# EAGLE design Initial Schematic (EAGLE 9.6.2)
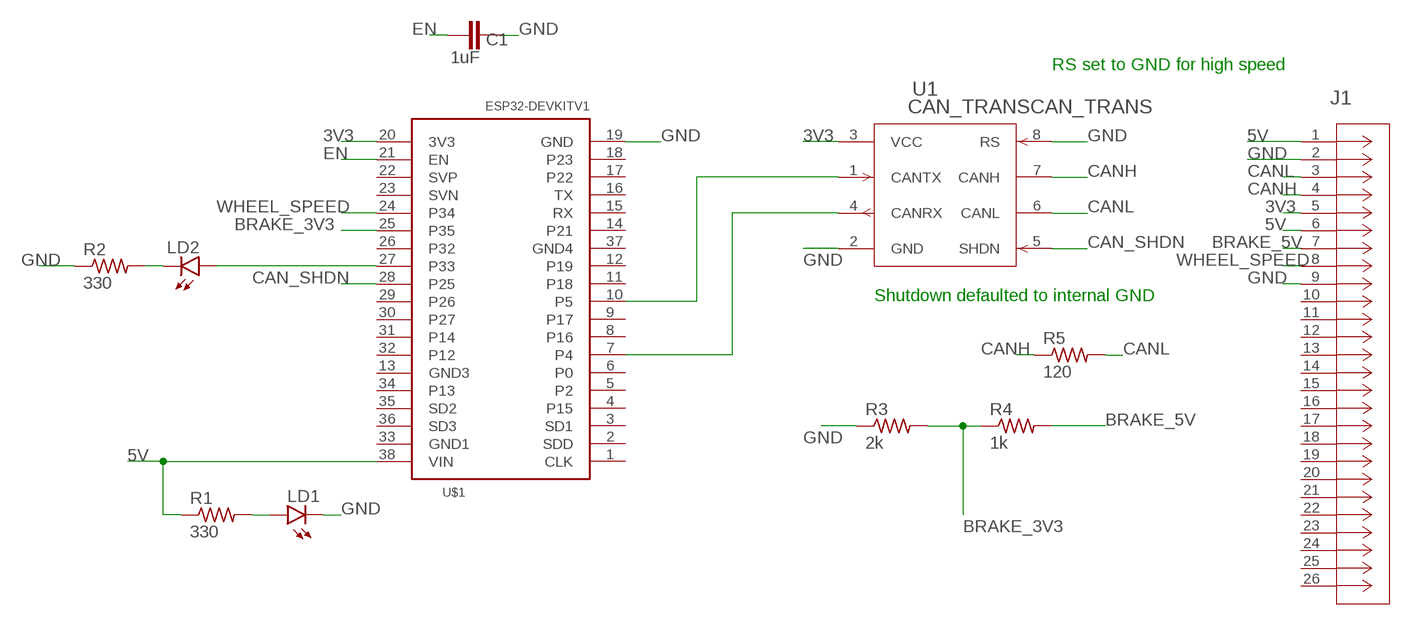
[diagram p0: schematic, sheet 1]

## Parts
C1  1uF  CAPACITORC1206  [C1206]
J1  CONNECTOR  [CONN26_9-6437287-8_TEC]
LD1  PL006-WCR21  [SOT23]
LD2  PL006-WCR21  [SOT23]
R1  330  RESISTORR1206  [R1206]
R2  330  RESISTORR1206  [R1206]
R3  2k  RESISTORR1206  [R1206]
R4  1k  RESISTORR1206  [R1206]
R5  120  RESISTORR1206  [R1206]
U1  CAN_TRANSCAN_TRANS  [MAX3051ESA+]
U$1  ESP32DEVKITV1  [ESP32-DEVKITV1]

## Nets
3V3: J1.5 U1.3(VCC) U$1.20(3V3)
5V: J1.1 J1.6 R1.1 U$1.38(VIN)
BRAKE_3V3: R3.2 R4.1 U$1.25(P35)
BRAKE_5V: J1.7 R4.2
CAN_SHDN: U1.5(SHDN) U$1.28(P25)
CANH: J1.4 R5.1 U1.7(CANH)
CANL: J1.3 R5.2 U1.6(CANL)
EN: C1.2 U$1.21(EN)
GND: C1.1 J1.2 J1.9 LD1.1(C) R2.1 R3.1 U1.2(GND) U1.8(RS) U$1.19(GND)
N$1: U1.1(CANTX) U$1.10(P5)
N$2: LD1.3(A) R1.2
N$3: U1.4(CANRX) U$1.7(P4)
N$4: LD2.3(A) U$1.27(P33)
N$5: LD2.1(C) R2.2
WHEEL_SPEED: J1.8 U$1.24(P34)
Unconnected: J1.10 J1.11 J1.12 J1.13 J1.14 J1.15 J1.16 J1.17 J1.18 J1.19 J1.20 J1.21 J1.22 J1.23 J1.24 J1.25 J1.26 U$1.1(CLK) U$1.2(SDD) U$1.3(SD1) U$1.4(P15) U$1.5(P2) U$1.6(P0) U$1.8(P16) U$1.9(P17) U$1.11(P18) U$1.12(P19) U$1.13(GND3) U$1.14(P21) U$1.15(RX) U$1.16(TX) U$1.17(P22) U$1.18(P23) U$1.22(SVP) U$1.23(SVN) U$1.26(P32) U$1.29(P26) U$1.30(P27) U$1.31(P14) U$1.32(P12) U$1.33(GND1) U$1.34(P13) U$1.35(SD2) U$1.36(SD3) U$1.37(GND4)

## Notes on the sheet
- RS set to GND for high speed
- Shutdown defaulted to internal GND

## Library data of the parts
C1 = NFR23:CAPACITOR: CAPACITOR, European symbol
J1 = NFR23:CONNECTOR; COPYRIGHT: Copyright (C) 2022 Ultra Librarian. All rights reserved.; DIGI-KEY_PART_NUMBER_1: A126097-ND; MANUFACTURER_PART_NUMBER: 9-6437287-8; MFR_NAME: TE Connectivity; TYPE: -
LD1 LD2 = led:PL006*: PLH006 Series SMD LED SOT23 PLH006-WCR21 Super Red PLH006-WCR12 High Eff Red PLH006-WCG13 Green PLH006-WCY01 Yellow www.p-tec.net Source: http://www.wittig-electronic.de/PTEC/PL006Series.pdf
R1-R5 = NFR23:RESISTOR: RESISTOR, American symbol; SPICEPREFIX: R
U1 = NFR23:CAN_TRANS; COPYRIGHT: Copyright (C) 2022 Ultra Librarian. All rights reserved.; DIGI-KEY_PART_NUMBER_1: MAX3051ESA+-ND; MANUFACTURER_PART_NUMBER: MAX3051ESA+; MFR_NAME: Maxim Integrated Products
U$1 = NFR23:ESP32DEVKITV1

## Board
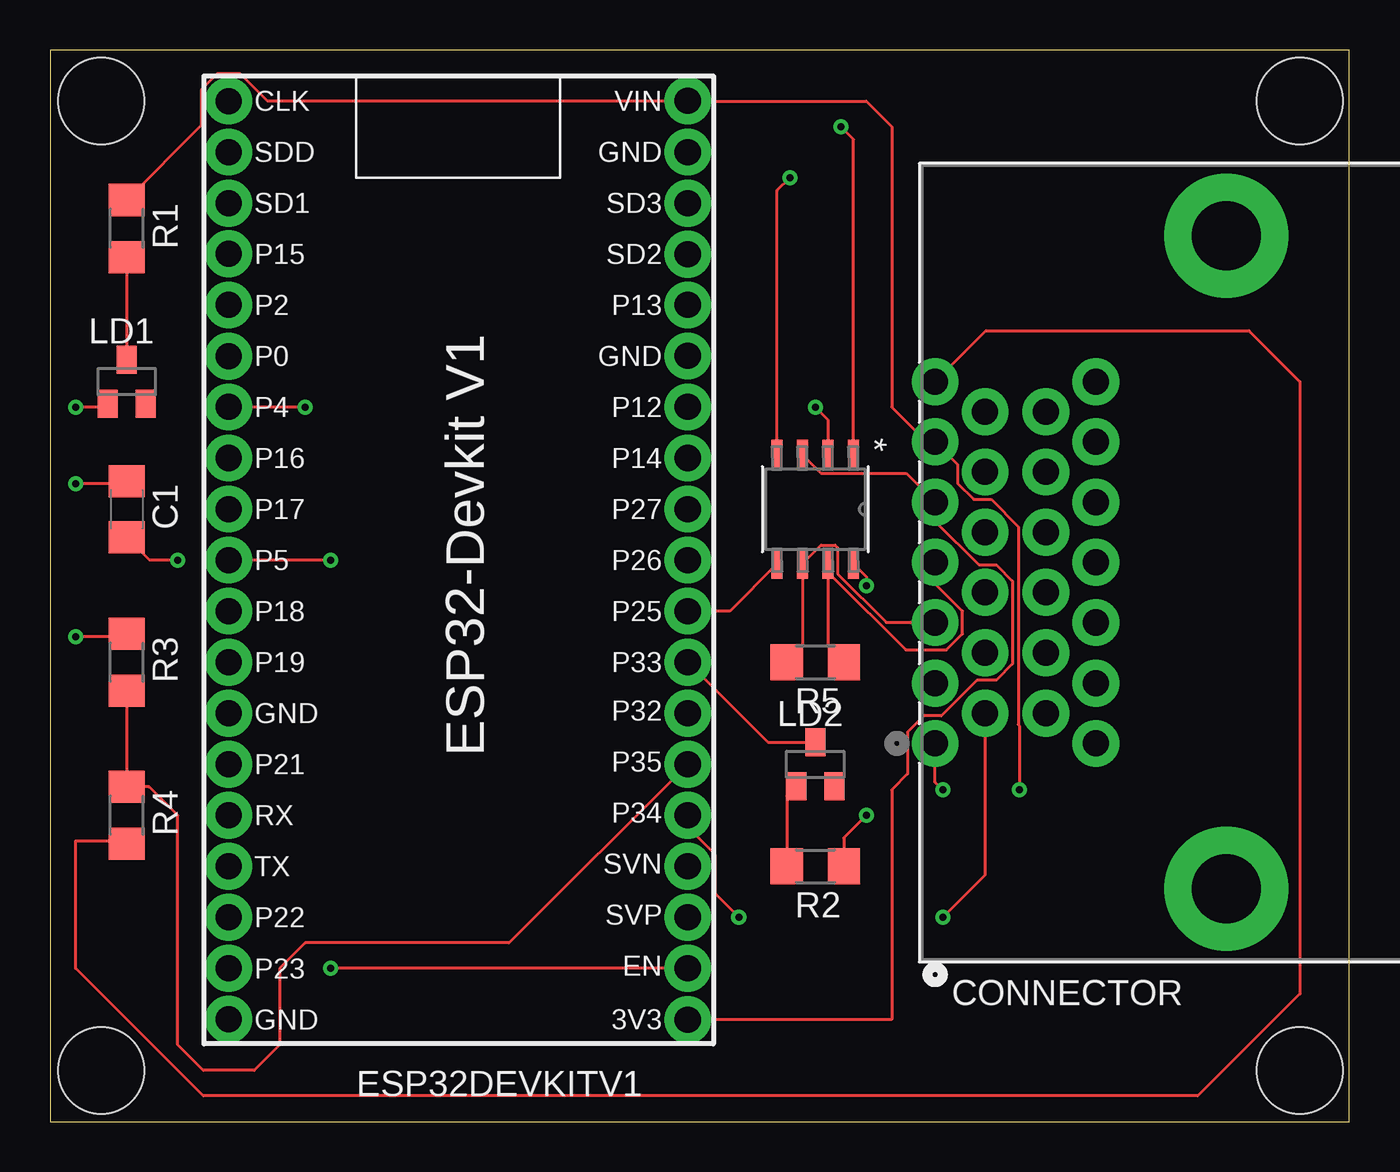
[diagram p1: board, top side]
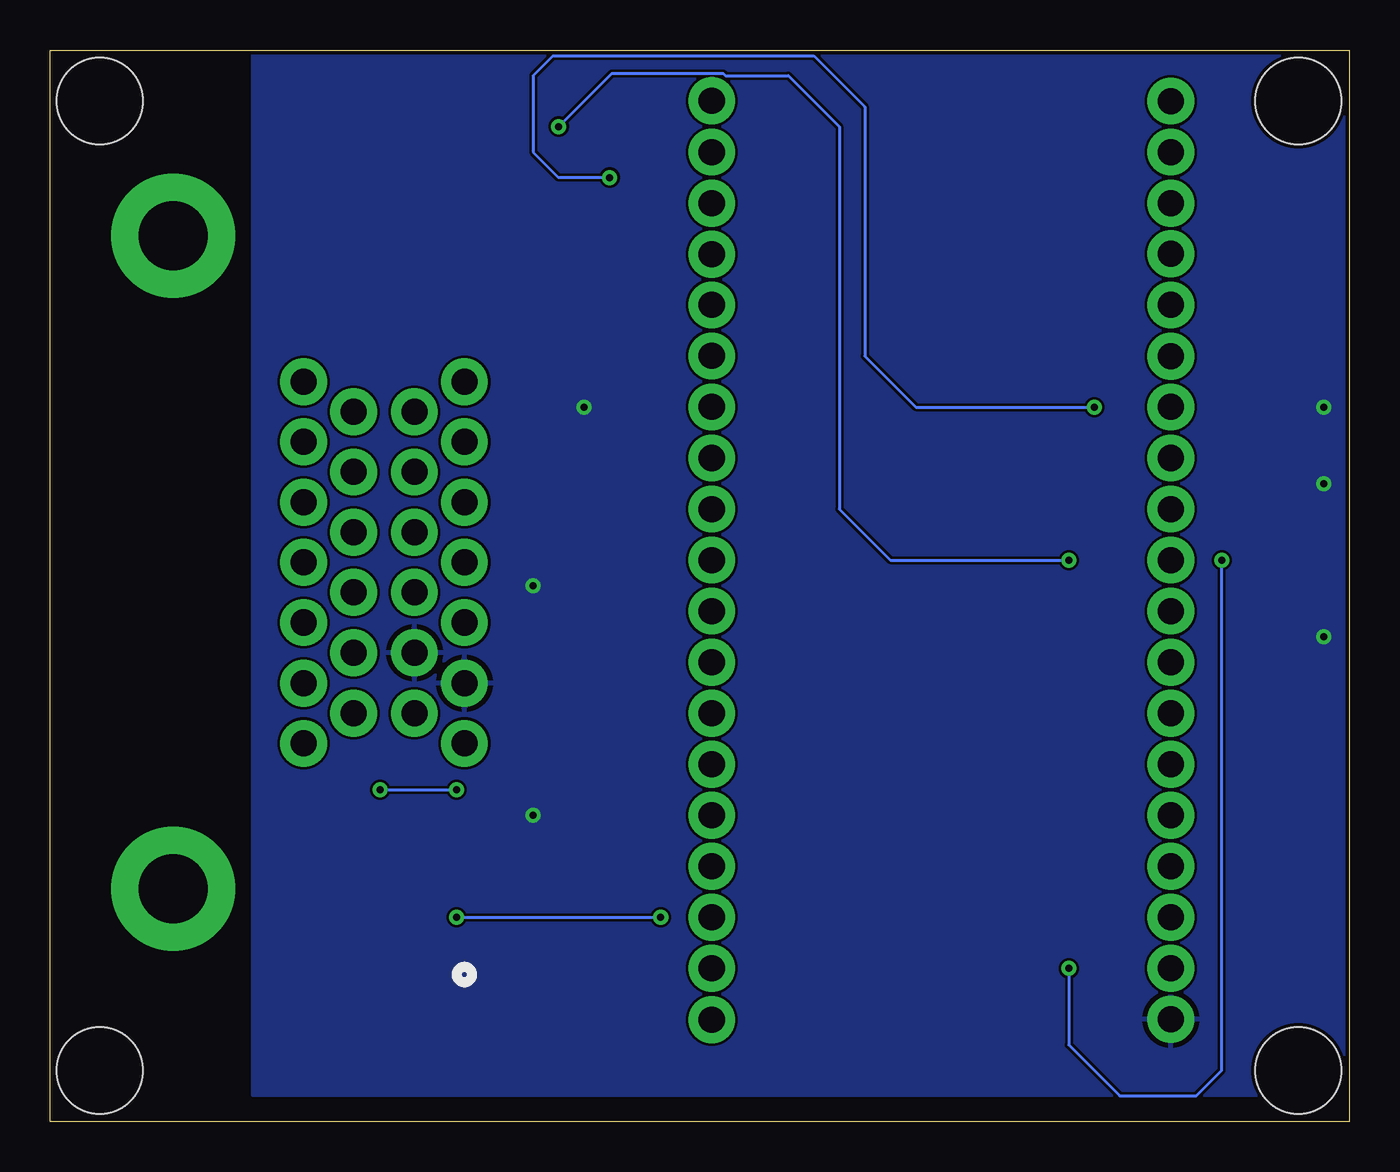
[diagram p2: board, bottom side, seen from below]

Size 64.69 x 53.33 mm. Coordinates in mm from the lower left corner, seen from the top.
Outline: 0,0 64.69,0 64.69,53.33 0,53.33 0,0
Copper layers (1*16): Top 0.035mm / dielectric 1.6mm / Bottom 0.035mm
Design rules "jlcpcb-2layers": minimum track width 5mil, minimum drill 0.3mm, track to track 5mil, track to pad 5mil, pad to pad 5mil, via to via 5mil, smd to smd 5mil, copper to edge 0.2mm, drill to drill 6mil, minimum pad ring 10mil, minimum via ring 3mil, stop-mask expansion 4mil, vias tented up to drill 0mil, thermal gap 10mil
Holes 4.3 mm at 2.54,50.8 2.54,2.54 62.23,2.54 62.23,50.8

### Footprints (pad centres in the part's own frame; a part is rotated, then mirrored left to right if it is on the bottom)
C1206 = smd 1.6 x 1.8: 1 -1.4,0; 2 1.4,0
CONN26_9-6437287-8_TEC = drill 1.295 pad 1.803: 1 -18.009,8.001; 2 -15.011,8.001; 3 -11.989,8.001; 4 -8.992,8.001; 5 -5.994,8.001; 6 -2.997,8.001; 7 0,8.001; 8 -16.51,5.512; 9 -13.487,5.512; 10 -10.49,5.512; 11 -7.493,5.512; 12 -4.496,5.512; 13 -1.499,5.512; 14 -16.51,2.489; 15 -13.487,2.489; 16 -10.49,2.489; 17 -7.493,2.489; 18 -4.496,2.489; 19 -1.499,2.489; 20 -18.009,0; 21 -15.011,0; 22 -11.989,0; 23 -8.992,0; 24 -5.994,0; 25 -2.997,0; 26 0,0 | drill 3.429 pad 3.429: 27 -25.248,-6.502; 28 7.264,-6.502
SOT23 = smd 1 x 1.4: 1 -0.95,-1.1; 2 0.95,-1.1; 3 0,1.1
R1206 = smd 1.6 x 1.803: 1 -1.422,0; 2 1.422,0
MAX3051ESA+ = smd 1.46 x 0.533: 1 -2.724,1.905; 2 -2.724,0.635; 3 -2.724,-0.635; 4 -2.724,-1.905; 5 2.724,-1.905; 6 2.724,-0.635; 7 2.724,0.635; 8 2.724,1.905
ESP32-DEVKITV1 = drill 1.295: 1 -22.86,-12.7; 2 -20.32,-12.7; 3 -17.78,-12.7; 4 -15.25,-12.7; 5 -12.71,-12.7; 6 -10.16,-12.7; 7 -7.63,-12.7; 8 -5.09,-12.7; 9 -2.55,-12.7; 10 -0.01,-12.7; 11 2.53,-12.7; 12 5.07,-12.7; 13 7.62,-12.7; 14 10.15,-12.7; 15 12.69,-12.7; 16 15.23,-12.7; 17 17.77,-12.7; 18 20.31,-12.7; 19 22.85,-12.7; 20 22.87,10.16; 21 20.31,10.16; 22 17.77,10.16; 23 15.23,10.16; 24 12.69,10.16; 25 10.15,10.16; 26 7.61,10.16; 27 5.07,10.16; 28 2.53,10.16; 29 -0.01,10.16; 30 -2.55,10.16; 31 -5.09,10.16; 32 -7.63,10.16; 33 -10.17,10.16; 34 -12.71,10.16; 35 -15.24,10.16; 36 -17.78,10.16; 37 -20.32,10.16; 38 -22.87,10.16

### Placement (x,y rotation side)
C1  3.81,30.48 270 top
J1  52.07,36.83 90 top
LD1  3.81,36.83 0 top
LD2  38.1,17.78 0 top
R1  3.81,44.45 270 top
R2  38.1,12.7 180 top
R3  3.81,22.86 270 top
R4  3.81,15.24 270 top
R5  38.1,22.86 180 top
U1  38.1,30.48 270 top
U$1  21.59,27.94 270 top

### Tracks (layer width: path | path; a pad name or v marks a point on that pad's centre or on a via)
3V3
  Top 0.152: U1.3 38.27,32.4 38.27,32.39 38.38,32.27 42.63,32.27 J1.5 44.07,29.89 46.25,27.71 47.12,27.71 47.93,26.91 47.93,22.78 47.12,21.97 46.16,21.97 44.38,20.19 43.5,20.19 42.7,19.39 42.7,17.3 41.91,16.51 41.91,5.08 41.9,5.07 U$1.20
5V  (via drill 0.35 pad 0.75)
  Top 0.152: R1.1 7.52,49.58 7.52,51.37 8.32,52.17 9.46,52.17 10.82,50.81 U$1.38 40.64,50.8 41.91,49.53 41.91,35.56 43.64,33.83 J1.6 45.19,32.71 45.19,31.77 45.99,30.96 46.87,30.96 48.21,29.62 48.21,19.75 48.26,19.7 v48.26,16.51 | v44.45,16.51 44.07,16.89 J1.1
  Bottom 0.152: v48.26,16.51 v44.45,16.51
BRAKE_3V3
  Top 0.152: R3.2 R4.1 4.93,16.66 6.35,15.24 6.35,3.81 7.62,2.54 10.16,2.54 11.43,3.81 11.43,7.62 12.7,8.89 22.85,8.89 U$1.25
BRAKE_5V
  Top 0.152: J1.7 46.61,39.37 59.69,39.37 62.23,36.83 62.23,6.35 57.15,1.27 7.62,1.27 1.27,7.62 1.27,13.97 3.66,13.97 R4.2
CAN_SHDN
  Top 0.152: U1.5 33.85,25.41 U$1.28
CANH
  Top 0.152: R5.1 38.73,23.65 U1.7 38.92,27.56 38.92,27.16 42.61,23.47 44.64,23.47 45.44,24.27 45.44,25.41 44.07,26.78 J1.4
CANL
  Top 0.152: R5.2 37.47,23.65 U1.6 38.27,28.56 38.27,28.57 38.38,28.69 39.09,28.69 39.2,28.57 39.2,27.27 41.63,24.84 J1.3
EN  (via drill 0.35 pad 0.75)
  Top 0.152: U$1.21 v13.98,7.63 v13.97,7.62 | v6.35,27.94 4.95,27.94 C1.2
  Bottom 0.152: v13.97,7.62 13.97,3.81 11.43,1.27 7.62,1.27 6.35,2.54 v6.35,27.94
GND  (via drill 0.35 pad 0.75)
  Top 0.152: LD1.1 2.69,35.56 v1.27,35.56 | C1.1 3.68,31.75 v1.27,31.75 | R3.1 3.66,24.13 v1.27,24.13 | R2.1 39.52,14.12 v40.64,15.24 | v38.1,35.56 38.73,34.92 U1.2 | U1.8 40.64,27.12 v40.64,26.67
  pour Bottom: 0,53.34 0,1.27 54.61,1.27 54.61,53.34
N$1  (via drill 0.35 pad 0.75)
  Top 0.152: U1.1 40.01,48.89 v39.37,49.53 | v13.97,27.94 U$1.10
  Bottom 0.152: v39.37,49.53 36.72,52.18 31.18,52.18 31.07,52.07 27.94,52.07 25.4,49.53 25.4,30.48 22.86,27.94 v13.97,27.94
N$2
  Top 0.152: R1.2 LD1.3
N$3  (via drill 0.35 pad 0.75)
  Top 0.152: U1.4 36.2,46.36 v36.83,46.99 | v12.7,35.56 U$1.7
  Bottom 0.152: v36.83,46.99 39.37,46.99 40.64,48.26 40.64,52.07 39.66,53.05 26.67,53.05 24.13,50.51 24.13,38.1 21.59,35.56 v12.7,35.56
N$4
  Top 0.152: U$1.27 35.74,18.88 LD2.3
N$5
  Top 0.152: LD2.1 36.68,16.21 R2.2
WHEEL_SPEED  (via drill 0.35 pad 0.75)
  Top 0.152: J1.8 46.56,12.27 v44.45,10.16 | v34.29,10.16 33.12,11.33 33.12,13.28 31.75,14.65 U$1.24
  Bottom 0.152: v44.45,10.16 v34.29,10.16